# EAGLE design SingleBoard (EAGLE 9.4.2)
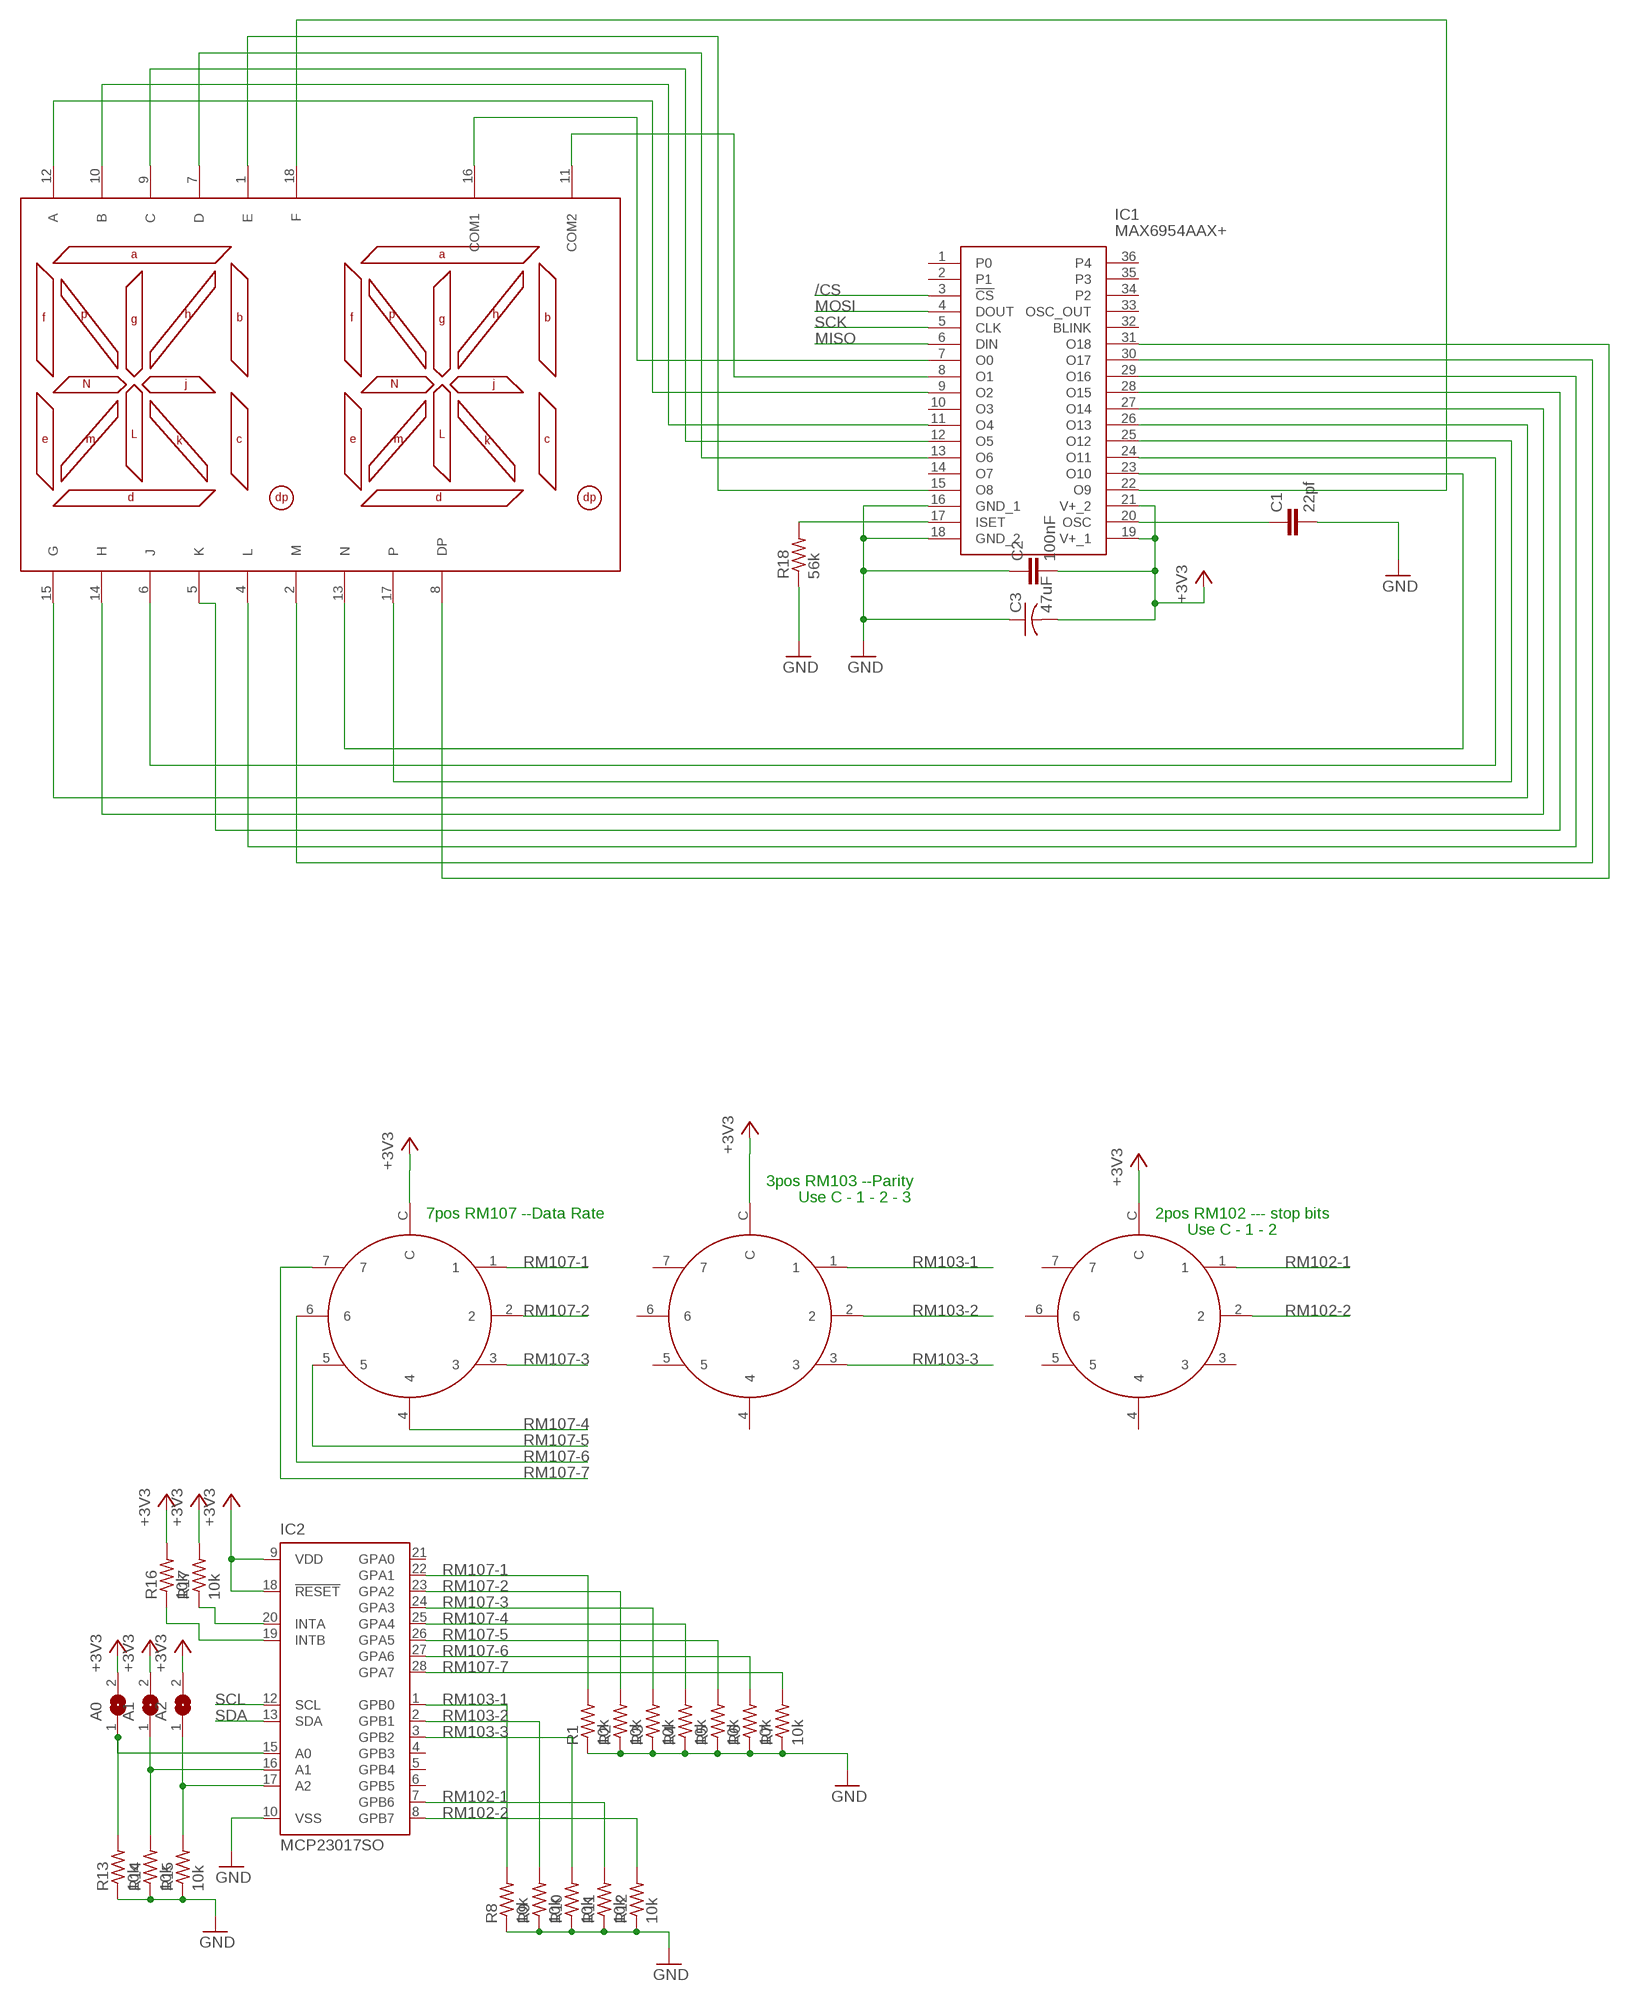
[diagram p0: schematic, sheet 1, part 1 of 2]
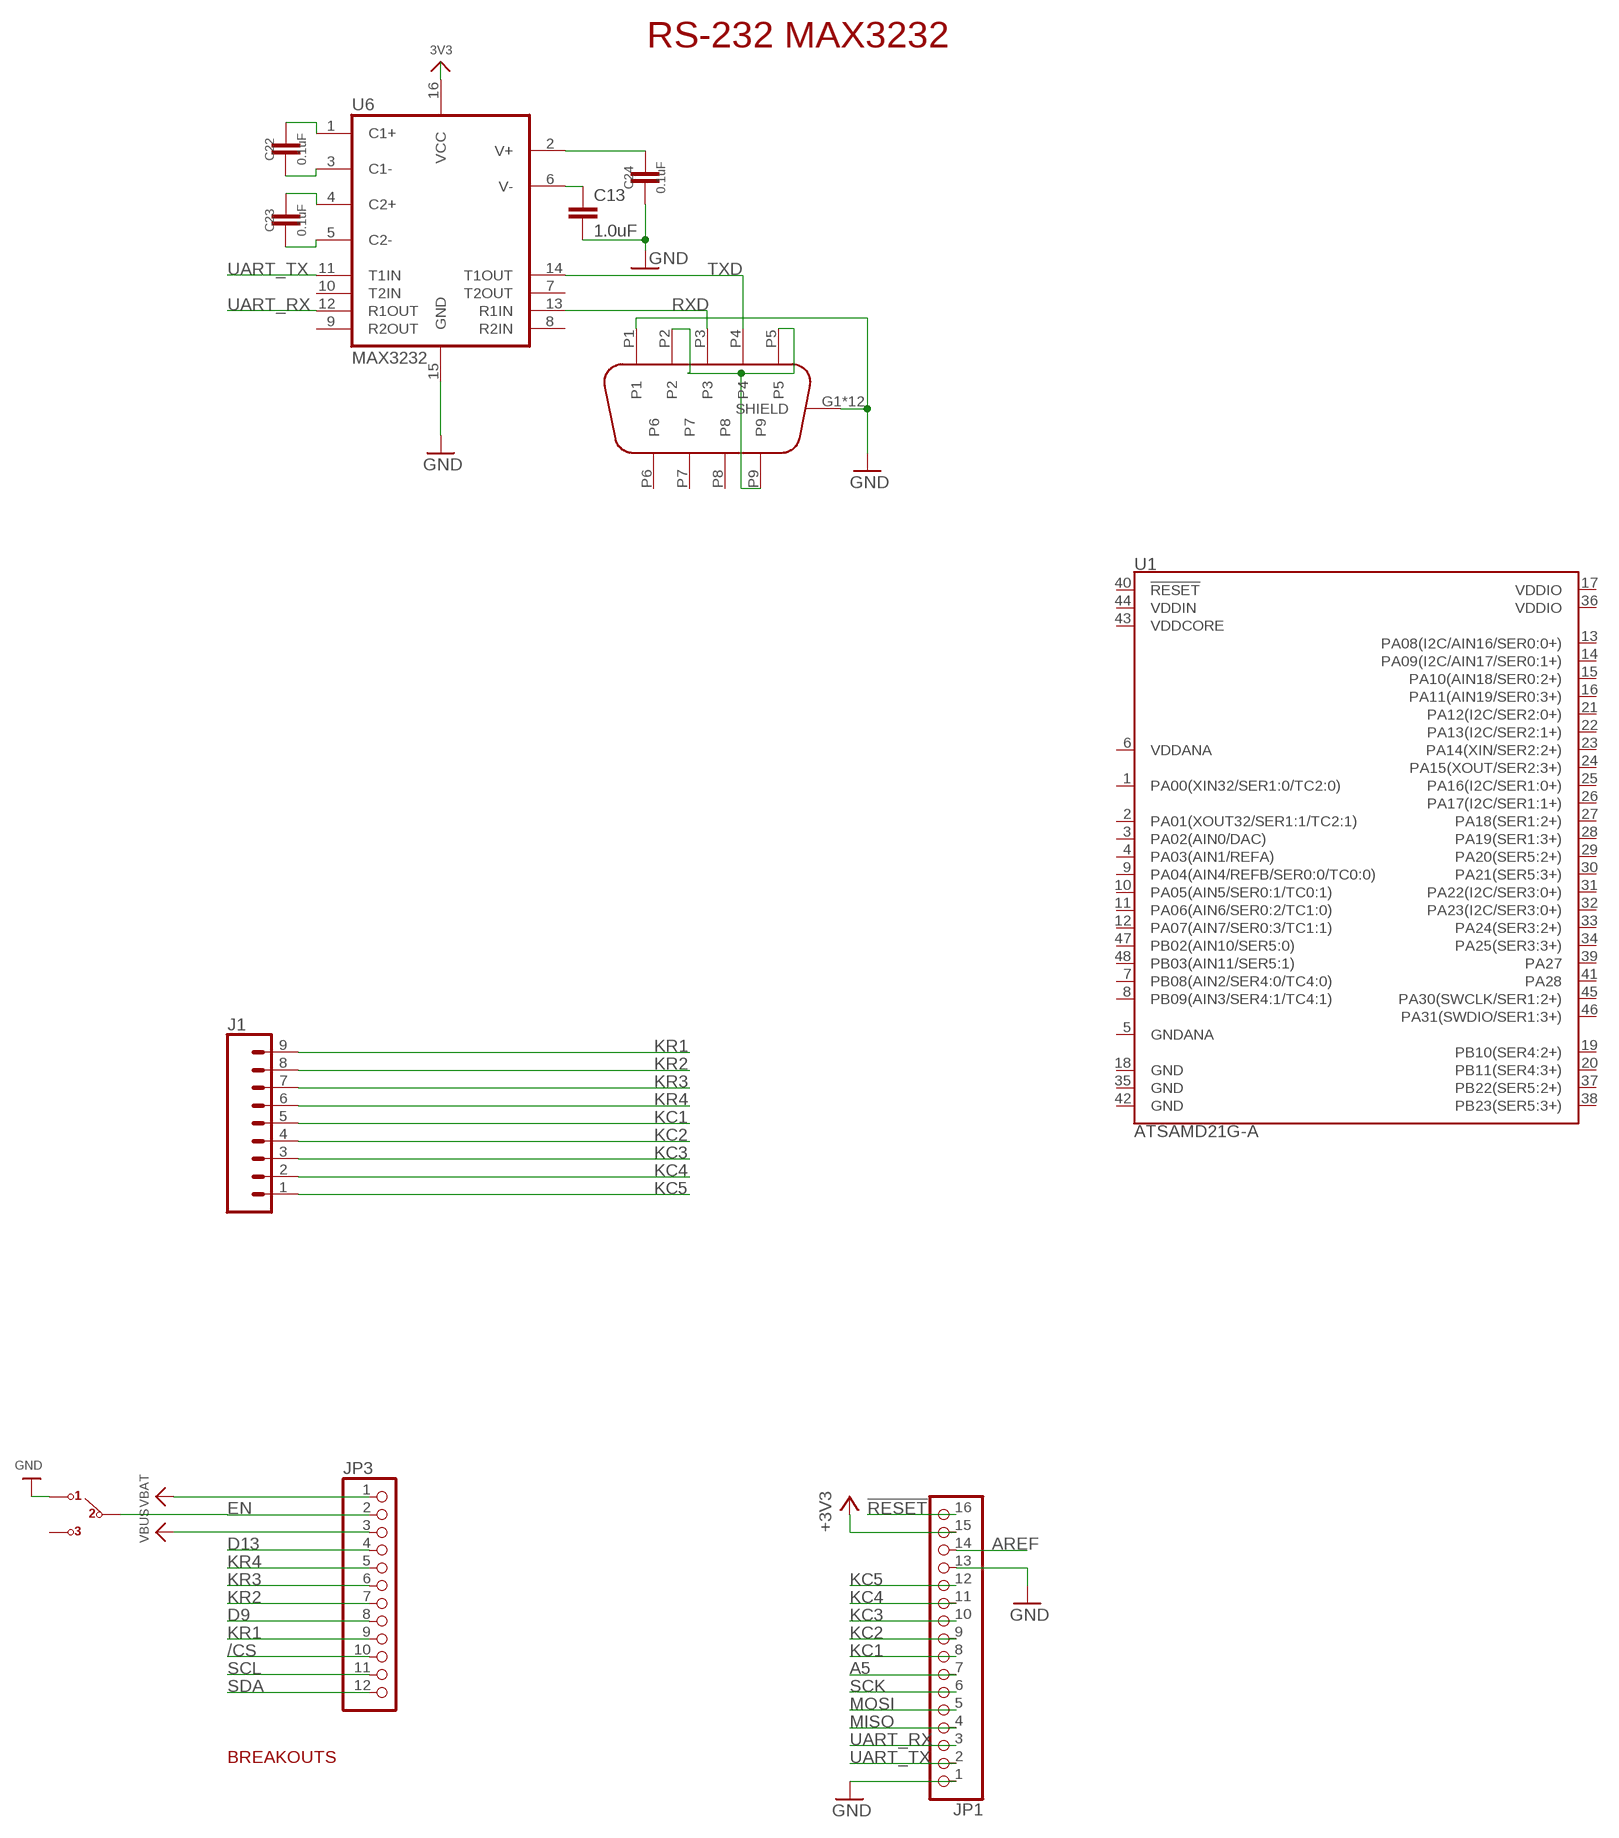
[diagram p1: schematic, sheet 1, part 2 of 2]

## Parts
A0  SJ  [SJ]
A1  SJ  [SJ]
A2  SJ  [SJ]
C1  22pf  1.0UF-0805-25V-(+80/-20%)  [0805]
C2  100nF  1.0UF-0805-25V-(+80/-20%)  [0805]
C3  47uF  C-USC1206  [C1206]
C13  1.0uF  1.0UF-0805-25V-10%  [0805]
C22  0.1uF  1.0UF-0805-25V-10%  [0805]
C23  0.1uF  1.0UF-0805-25V-10%  [0805]
C24  0.1uF  1.0UF-0805-25V-10%  [0805]
DE9FEMALE  EDGEMOUNTDE9  [DE09S065TLF]
IC1  MAX6954AAX+  [SOP80P1030X264-36N]
IC2  MCP23017SO  [SO28W]
J1  CONN_09  [1X09]
JP1  HEADER-1X16ROUND  [1X16_ROUND]
JP3  HEADER-1X12  [1X12_ROUND]
R1  10k  R-US_M0805  [M0805]
R2  10k  R-US_M0805  [M0805]
R3  10k  R-US_M0805  [M0805]
R4  10k  R-US_M0805  [M0805]
R5  10k  R-US_M0805  [M0805]
R6  10k  R-US_M0805  [M0805]
R7  10k  R-US_M0805  [M0805]
R8  10k  R-US_M0805  [M0805]
R9  10k  R-US_M0805  [M0805]
R10  10k  R-US_M0805  [M0805]
R11  10k  R-US_M0805  [M0805]
R12  10k  R-US_M0805  [M0805]
R13  10k  R-US_M0805  [M0805]
R14  10k  R-US_M0805  [M0805]
R15  10k  R-US_M0805  [M0805]
R16  10k  R-US_M0805  [M0805]
R17  10k  R-US_M0805  [M0805]
R18  56k  R-US_M0805  [M0805]
U1  ATSAMD21G-A  [TQFP-48]
U6  MAX3232  MAX2323SOIC16  [SO16]
U$1  BIG14SEG  [HDSP]
U$2  RM107772BCB  [RM107772BCB]
U$3  RM107772BCB  [RM107772BCB]
U$5  OS102011MA1QN1  [OS102011MA1QN1]
U$6  RM107772BCB  [RM107772BCB]

## Nets
3V3: U6.16(VCC)
!RESET: JP1.16
+3V3: A0.2 A1.2 A2.2 C2.2 C3.2 IC1.19(V+_1) IC1.21(V+_2) IC2.9(VDD) IC2.18(!RESET) JP1.15 R16.2 R17.2 U$2.C U$3.C U$6.C
/CS: IC1.3(!CS) JP3.10
A5: JP1.7
AREF: JP1.14
D9: JP3.8
D13: JP3.4
EN: JP3.2 U$5.P$2
GND: C1.2 C2.1 C3.1 C13.2 C24.2 DE9FEMALE.G1(SHIELD) DE9FEMALE.G2(SHIELD) DE9FEMALE.G3(SHIELD) DE9FEMALE.G4(SHIELD) DE9FEMALE.G5(SHIELD) DE9FEMALE.G6(SHIELD) DE9FEMALE.G7(SHIELD) DE9FEMALE.G8(SHIELD) DE9FEMALE.G9(SHIELD) DE9FEMALE.G10(SHIELD) DE9FEMALE.G11(SHIELD) DE9FEMALE.G12(SHIELD) DE9FEMALE.P1 IC1.16(GND_1) IC1.18(GND_2) IC2.10(VSS) JP1.1 JP1.13 R1.1 R2.1 R3.1 R4.1 R5.1 R6.1 R7.1 R8.1 R9.1 R10.1 R11.1 R12.1 R13.1 R14.1 R15.1 R18.1 U6.15(GND) U$5.P$1
KC1: J1.5 JP1.8
KC2: J1.4 JP1.9
KC3: J1.3 JP1.10
KC4: J1.2 JP1.11
KC5: J1.1 JP1.12
KR1: J1.9 JP3.9
KR2: J1.8 JP3.7
KR3: J1.7 JP3.6
KR4: J1.6 JP3.5
MISO: IC1.6(DIN) JP1.4
MOSI: IC1.4(DOUT) JP1.5
N$1: IC1.7(O0) U$1.16(COM1)
N$2: IC1.9(O2) U$1.12(A)
N$3: IC1.11(O4) U$1.10(B)
N$4: IC1.12(O5) U$1.9(C)
N$5: IC1.13(O6) U$1.7(D)
N$6: IC1.15(O8) U$1.1(E)
N$7: IC1.22(O9) U$1.18(F)
N$8: IC1.23(O10) U$1.13(N)
N$9: IC1.24(O11) U$1.6(J)
N$10: IC1.25(O12) U$1.17(P)
N$11: IC1.26(O13) U$1.15(G)
N$12: IC1.27(O14) U$1.14(H)
N$13: IC1.28(O15) U$1.5(K)
N$14: IC1.29(O16) U$1.4(L)
N$15: IC1.30(O17) U$1.2(M)
N$16: IC1.31(O18) U$1.8(DP)
N$17: IC1.8(O1) U$1.11(COM2)
N$18: C22.2 U6.3(C1-)
N$19: C22.1 U6.1(C1+)
N$20: C23.1 U6.4(C2+)
N$21: C23.2 U6.5(C2-)
N$22: C24.1 U6.2(V+)
N$23: C13.1 U6.6(V-)
N$24: DE9FEMALE.P2 DE9FEMALE.P5 DE9FEMALE.P9
N$25: A0.1 IC2.15(A0) R13.2
N$26: A1.1 IC2.16(A1) R14.2
N$27: A2.1 IC2.17(A2) R15.2
N$28: IC2.19(INTB) R16.1
N$29: IC2.20(INTA) R17.1
N$30: C1.1 IC1.20(OSC)
N$31: IC1.17(ISET) R18.2
RM102-1: IC2.7(GPB6) R11.2 U$6.1
RM102-2: IC2.8(GPB7) R12.2 U$6.2
RM103-1: IC2.1(GPB0) R8.2 U$3.1
RM103-2: IC2.2(GPB1) R9.2 U$3.2
RM103-3: IC2.3(GPB2) R10.2 U$3.3
RM107-1: IC2.22(GPA1) R1.2 U$2.1
RM107-2: IC2.23(GPA2) R2.2 U$2.2
RM107-3: IC2.24(GPA3) R3.2 U$2.3
RM107-4: IC2.25(GPA4) R4.2 U$2.4
RM107-5: IC2.26(GPA5) R5.2 U$2.5
RM107-6: IC2.27(GPA6) R6.2 U$2.6
RM107-7: IC2.28(GPA7) R7.2 U$2.7
RXD: DE9FEMALE.P3 U6.13(R1IN)
SCK: IC1.5(CLK) JP1.6
SCL: IC2.12(SCL) JP3.11
SDA: IC2.13(SDA) JP3.12
TXD: DE9FEMALE.P4 U6.14(T1OUT)
UART_RX: JP1.3 U6.12(R1OUT)
UART_TX: JP1.2 U6.11(T1IN)
VBAT: JP3.1
VBUS: JP3.3
Unconnected: DE9FEMALE.P6 DE9FEMALE.P7 DE9FEMALE.P8 IC1.1(P0) IC1.2(P1) IC1.10(O3) IC1.14(O7) IC1.32(BLINK) IC1.33(OSC_OUT) IC1.34(P2) IC1.35(P3) IC1.36(P4) IC2.4(GPB3) IC2.5(GPB4) IC2.6(GPB5) IC2.21(GPA0) U1.1(PA00(XIN32/SER1:0/TC2:0)) U1.2(PA01(XOUT32/SER1:1/TC2:1)) U1.3(PA02(AIN0/DAC)) U1.4(PA03(AIN1/REFA)) U1.5(GNDANA) U1.6(VDDANA) U1.7(PB08(AIN2/SER4:0/TC4:0)) U1.8(PB09(AIN3/SER4:1/TC4:1)) U1.9(PA04(AIN4/REFB/SER0:0/TC0:0)) U1.10(PA05(AIN5/SER0:1/TC0:1)) U1.11(PA06(AIN6/SER0:2/TC1:0)) U1.12(PA07(AIN7/SER0:3/TC1:1)) U1.13(PA08(I2C/AIN16/SER0:0+)) U1.14(PA09(I2C/AIN17/SER0:1+)) U1.15(PA10(AIN18/SER0:2+)) U1.16(PA11(AIN19/SER0:3+)) U1.17(VDDIO) U1.18(GND) U1.19(PB10(SER4:2+)) U1.20(PB11(SER4:3+)) U1.21(PA12(I2C/SER2:0+)) U1.22(PA13(I2C/SER2:1+)) U1.23(PA14(XIN/SER2:2+)) U1.24(PA15(XOUT/SER2:3+)) U1.25(PA16(I2C/SER1:0+)) U1.26(PA17(I2C/SER1:1+)) U1.27(PA18(SER1:2+)) U1.28(PA19(SER1:3+)) U1.29(PA20(SER5:2+)) U1.30(PA21(SER5:3+)) U1.31(PA22(I2C/SER3:0+)) U1.32(PA23(I2C/SER3:0+)) U1.33(PA24(SER3:2+)) U1.34(PA25(SER3:3+)) U1.35(GND) U1.36(VDDIO) U1.37(PB22(SER5:2+)) U1.38(PB23(SER5:3+)) U1.39(PA27) U1.40(!RESET!) U1.41(PA28) U1.42(GND) U1.43(VDDCORE) U1.44(VDDIN) U1.45(PA30(SWCLK/SER1:2+)) U1.46(PA31(SWDIO/SER1:3+)) U1.47(PB02(AIN10/SER5:0)) U1.48(PB03(AIN11/SER5:1)) U6.7(T2OUT) U6.8(R2IN) U6.9(R2OUT) U6.10(T2IN) U$3.4 U$3.5 U$3.6 U$3.7 U$5.CASE1(CASE) U$5.CASE2(CASE) U$5.P$3 U$6.3 U$6.4 U$6.5 U$6.6 U$6.7

## Notes on the sheet
- RS-232 MAX3232
- 3pos RM103 --Parity
- Use C - 1 - 2 - 3
- 7pos RM107 --Data Rate | 2pos RM102 --- stop bits
- Use C - 1 - 2
- BREAKOUTS

## Library data of the parts
A0 A1 A2 = jumper:SJ: SMD solder JUMPER
C1 C2 = SparkFun-Capacitors:1.0UF: 1µF ceramic capacitors A capacitor is a passive two-terminal electrical component used to store electrical energy temporarily in an electric field.; PROD_ID: CAP-11625; VALUE: 1.0uF
C3 = adafruit:C-US: CAPACITOR, American symbol
C13 = SparkFun-Capacitors:1.0UF: 1µF ceramic capacitors A capacitor is a passive two-terminal electrical component used to store electrical energy temporarily in an electric field.; PROD_ID: CAP-08064
C22-C24 = SparkFun-Capacitors:1.0UF: 1µF ceramic capacitors A capacitor is a passive two-terminal electrical component used to store electrical energy temporarily in an electric field.; PROD_ID: CAP-08064; VALUE: 1.0uF
DE9FEMALE = Serial:EDGEMOUNTDE9
IC1 = SamacSys_Parts:MAX6954AAX+: MAX6954AAX+, LED Display Driver, 16-Digits 128-Segments, 2.7 5.5 V, 36-Pin SSOP Source: Datasheet <https://componentsearchengine.com/Datasheets/1/MAX6954AAX .pdf>; DESCRIPTION: MAX6954AAX+, LED Display Driver, 16-Digits 128-Segments, 2.7 5.5 V, 36-Pin SSOP; HEIGHT: 2.64mm; MANUFACTURER_NAME: Maxim Integrated; MANUFACTURER_PART_NUMBER: MAX6954AAX+; MOUSER_PART_NUMBER: 700-MAX6954AAX; MOUSER_PRICE-STOCK: https://www.mouser.com/Search/Refine.aspx?Keyword=700-MAX6954AAX
IC2 = adafruit:MCP23017: http://ww1.microchip.com/downloads/en/DeviceDoc/21952a.pdf Source: http://ww1.microchip.com/downloads/en/DeviceDoc/21952a.pdf
J1 = SparkFun-Connectors:CONN_09: Multi connection point. Often used as Generic Header-pin footprint for 0.1 inch spaced/style header connections On any of the 0.1 inch spaced packages, you can populate with these: Break Away Headers - Straight <https://www.sparkfun.com/products/116> (PRT-00116) Break Away Male Headers - Right Angle <https://www.sparkfun.com/products/553> (PRT-00553) Female Headers <https://www.sparkfun.com/products/115> (PRT-00115) Break Away Headers - Machine Pin <https://www.sparkfun.com/products/117> (PRT-00117) Break Away Female Headers - Swiss Machine Pin <https://www.sparkfun.com/products/743> (PRT-00743) For SCREWTERMINALS and SPRING TERMINALS visit here: Screw Terimnals on SparkFun.com <https://www.sparkfun.com/search/results?term=Screw+Terminals> (5mm/3.5mm/2.54mm spacing) This device is also useful as a general connection point to wire up your design to another part of your project. Our various solder wires solder well into these plated through hole pads. Hook-Up Wire - Assortment (Stranded, 22 AWG) <https://www.sparkfun.com/products/11375> (PRT-11375) Hook-Up Wire - Assortment (Solid Core, 22 AWG) <https://www.sparkfun.com/products/11367> (PRT-11367) View the entire wire category on our website here <https://www.sparkfun.com/categories/141> Special notes: Molex polarized connector foot print use with SKU : PRT-08231 with associated crimp pins and housings. 1MM SMD Version SKU: PRT-10208 NOTES ON THE VARIANTS LOCK and LOCK_LONGPADS... This footprint was designed to help hold the alignment of a through-hole component (i.e. 6-pin header) while soldering it into place. You may notice that each hole has been shifted either up or down by 0.005 of an inch from it's more standard position (which is a perfectly straight line). This slight alteration caused the pins (the squares in the middle) to touch the edges of the holes. Because they are alternating, it causes a "brace" to hold the component in place. 0.005 has proven to be the perfect amount of "off-center" position when using our standard breakaway headers. Although looks a little odd when you look at the bare footprint, once you have a header in there, the alteration is very hard to notice. Also,if you push a header all the way into place, it is covered up entirely on the bottom side.
JP1 = microbuilder:HEADER-1X16: PIN HEADER
JP3 = microbuilder:HEADER-1X12
R1-R18 = resistor:R-US_: RESISTOR, American symbol
U1 = SparkFun-IC-Microcontroller:ATSAMD21G: Atmel SAMD21G SMART ARM-Based Microcontroller The Atmel ® | SMART ™ SAM D21 is a series of low-power microcontrollers using the 32-bit ARM ® Cortex ® -M0+ processor, and ranging from 32- to 64-pins with up to 256KB Flash and 32KB of SRAM. The SAM D21 devices operate at a maximum frequency of 48MHz and reach 2.46 CoreMark/MHz. They are designed for simple and intuitive migration with identical peripheral modules, hex compatible code, identical linear address map and pin compatible migration paths between all devices in the product series. All devices include intelligent and flexible peripherals, Atmel Event System for inter-peripheral signaling, and support for capacitive touch button, slider and wheel user interfaces. Datasheet <https://cdn.sparkfun.com/datasheets/Dev/Arduino/Boards/Atmel-42181-SAM-D21_Datasheet.pdf> SparkFun Products SparkFun SAMD21 Mini Breakout <https://www.sparkfun.com/products/13664> (DEV-13664) SparkFun SAMD21 Dev Breakout <https://www.sparkfun.com/products/13672> (DEV-13672); PROD_ID: IC-13064
U6 = SparkFun-IC-Comms:MAX2323: RS232 Transceiver This part covers 232 drivers that are compatible with the MAX3232. Sipex SP3232EB Datasheet <http://cdn.sparkfun.com/datasheets/Components/General%20IC/SP3232EBCA-L.pdf> SparkFun Products SOIC component <https://www.sparkfun.com/products/589> (COM-00589 / IC-08171) Retired DIP component (COM-00316 / IC-08446) SparkFun Transceiver Breakout - MAX3232 <https://www.sparkfun.com/products/11189> (BOB-11189) SparkFun XBee Explorer Serial <https://www.sparkfun.com/products/13225> (WRL-13225); PROD_ID: IC-08171
U$1 = Segment displays:BIG14SEG
U$2 U$3 U$6 = Segment displays:RM107772BCB
U$5 = FPC:OS102011MA1QN1

## Board
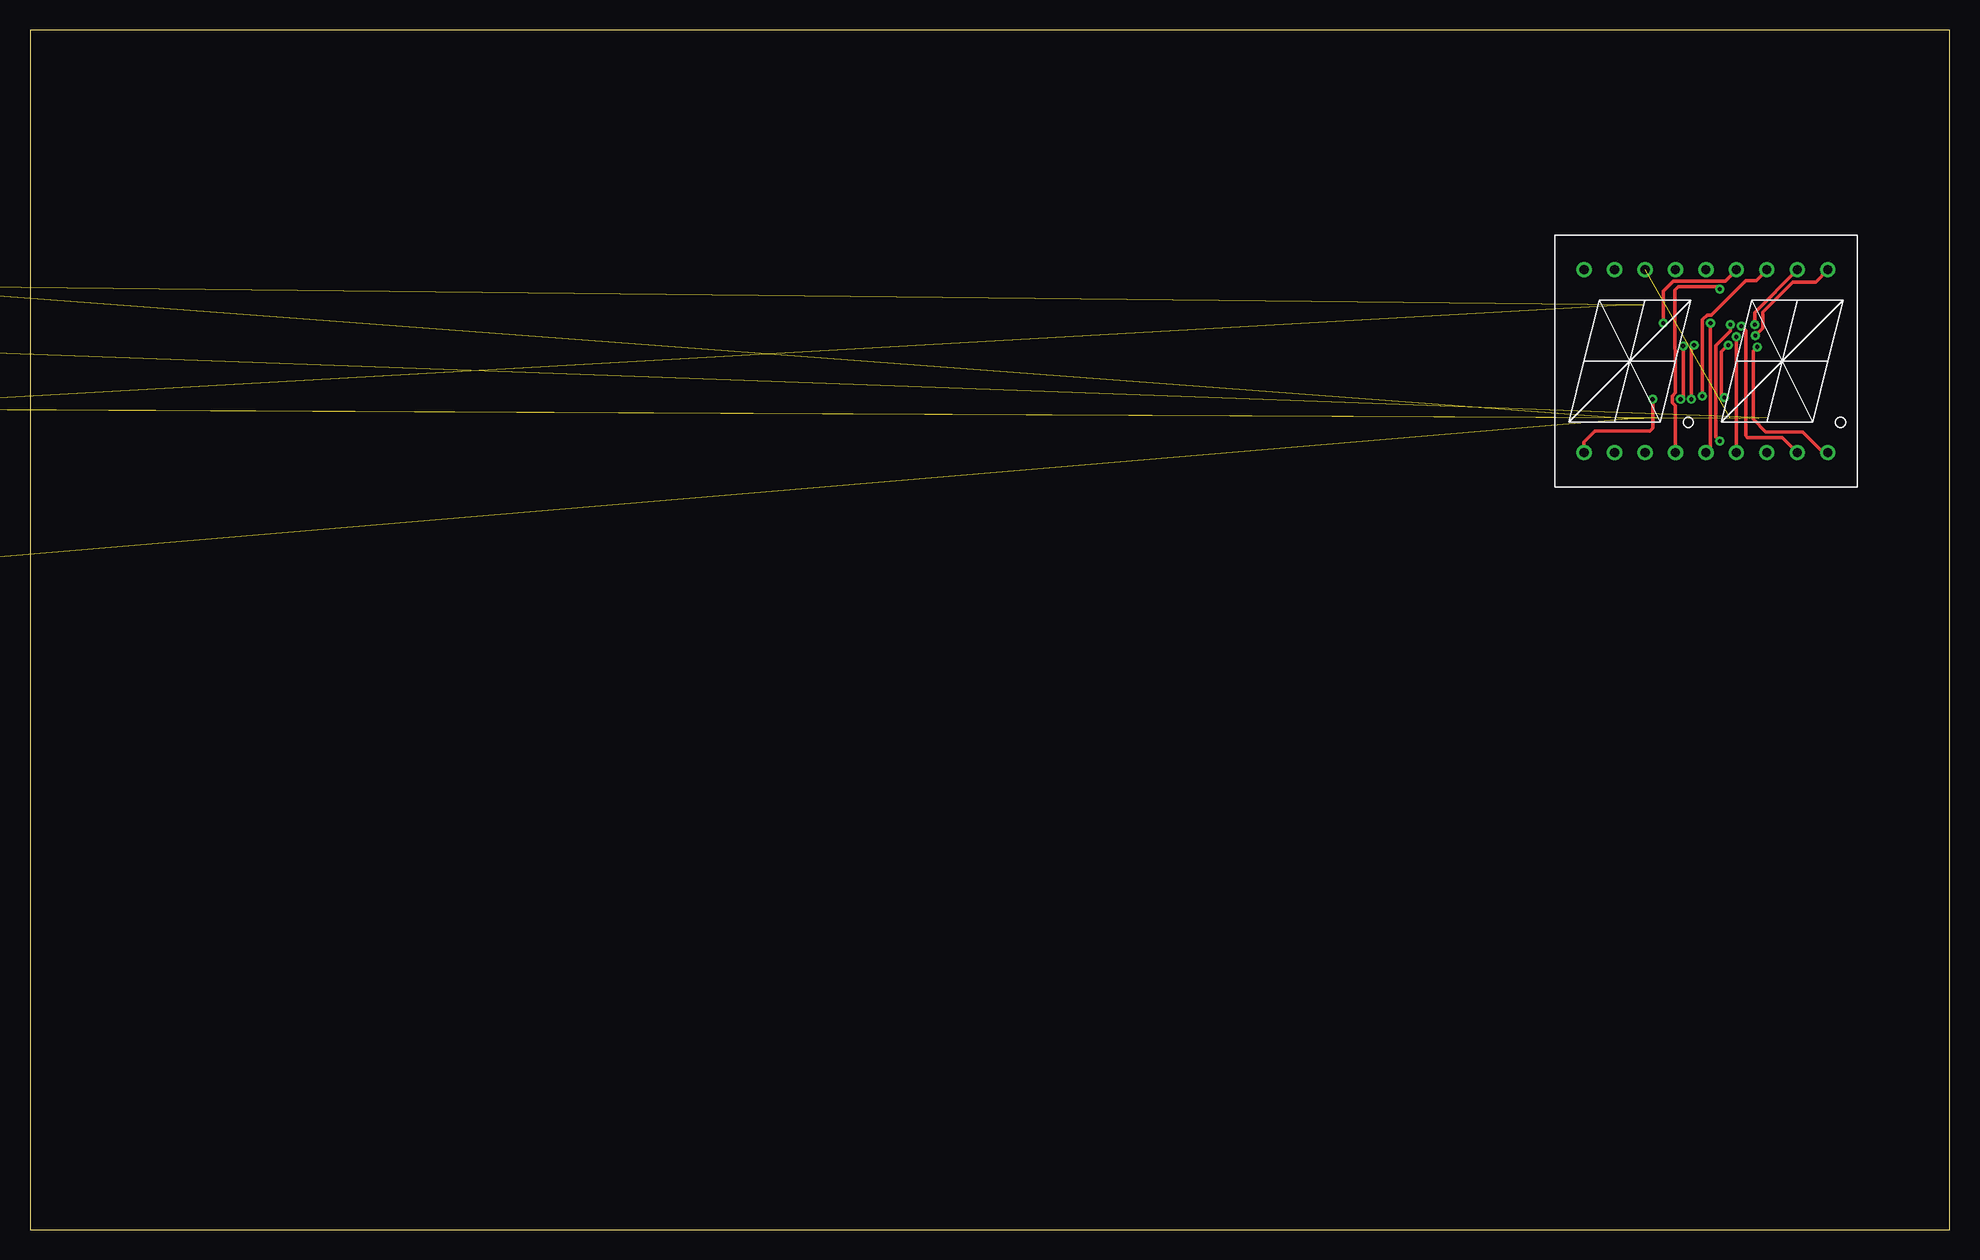
[diagram p2: board, top side]
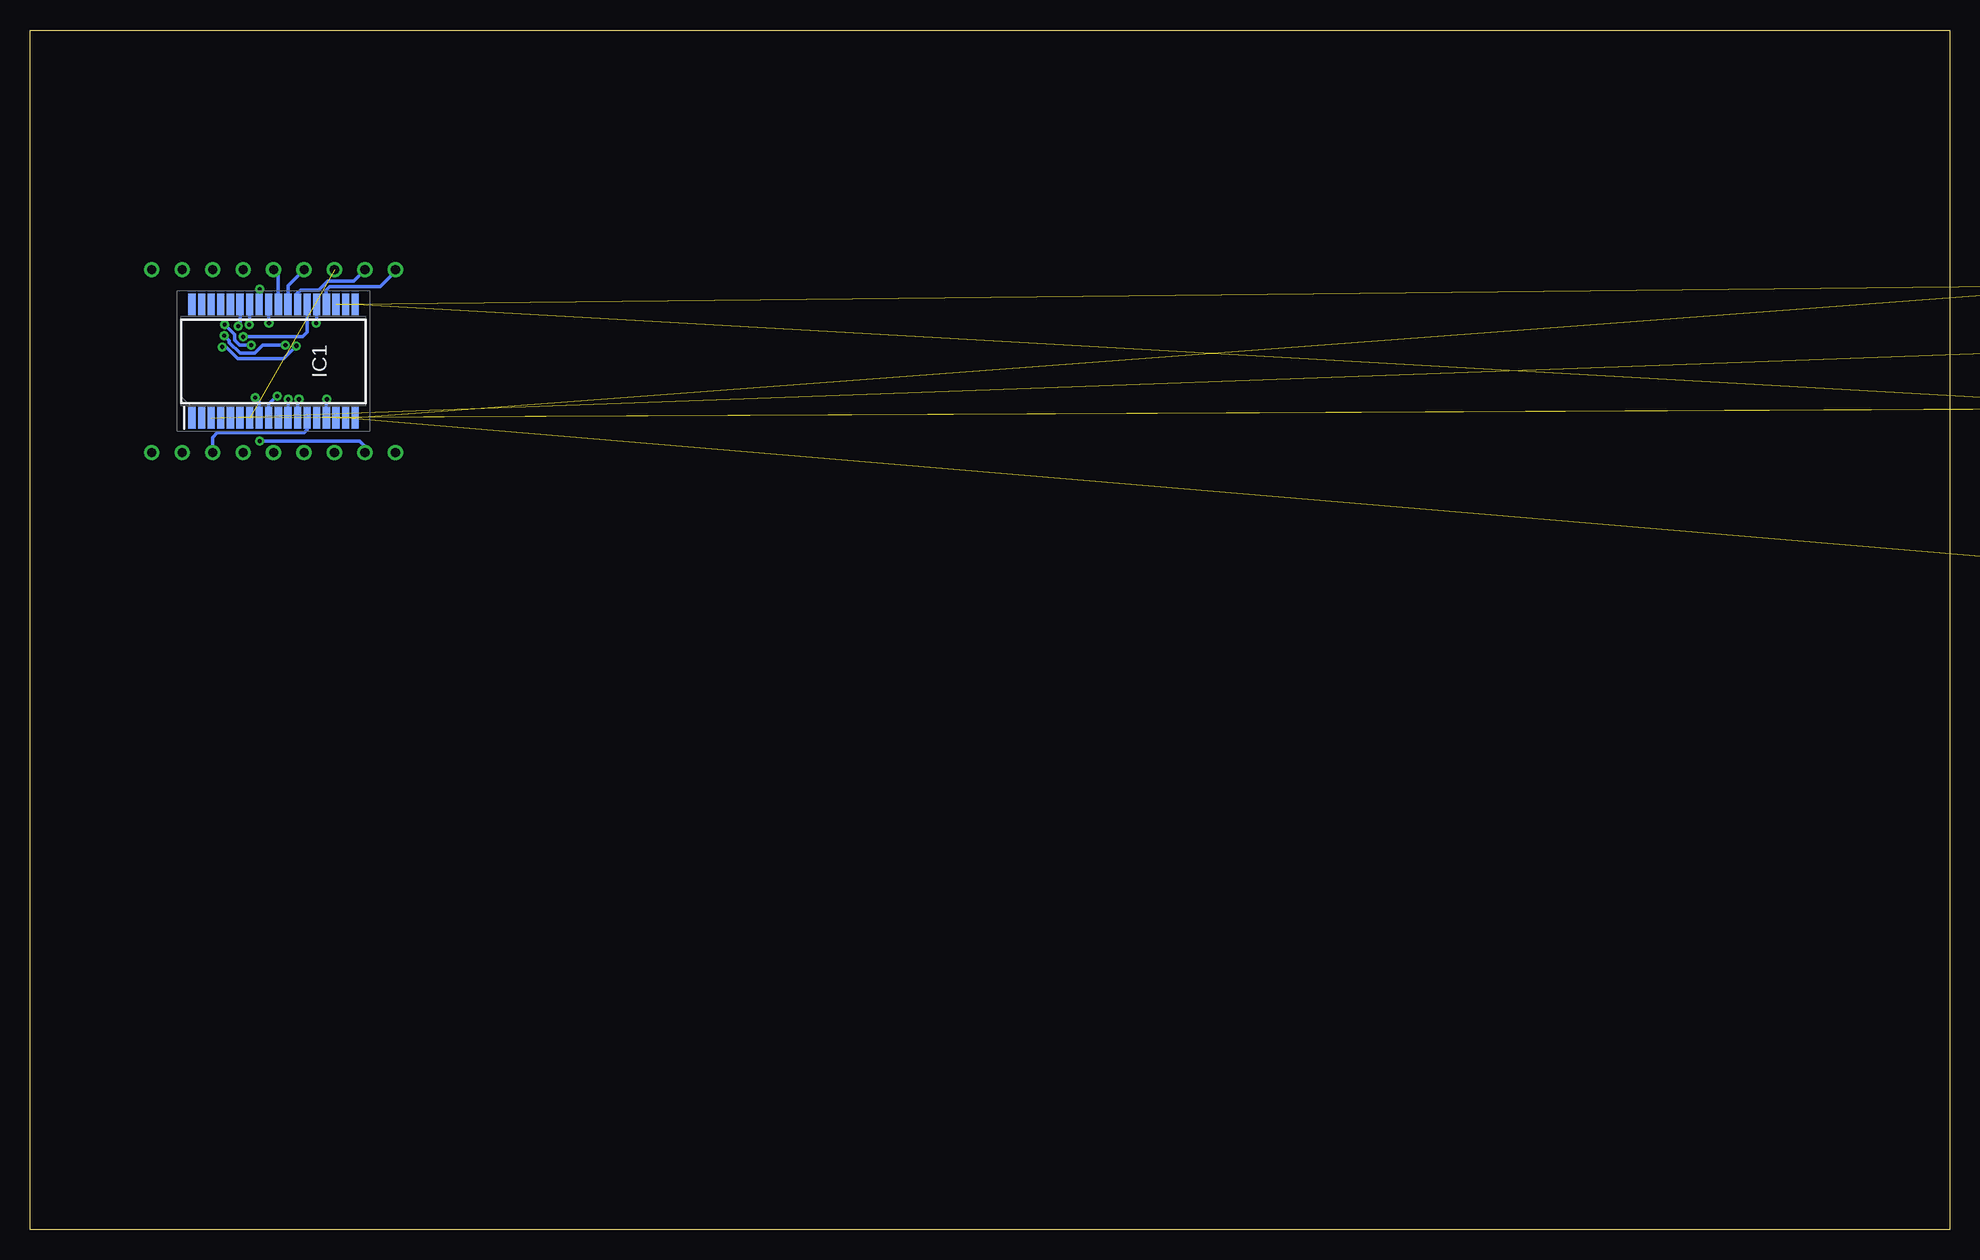
[diagram p3: board, bottom side, seen from below]

Size 160 x 100 mm. Coordinates in mm from the lower left corner, seen from the top.
Outline: 0,0 160,0 160,100 0,100 0,0
Copper layers (1*16): Top 0.035mm / dielectric 1.5mm / Bottom 0.035mm
Design rules "default": minimum track width 6mil, minimum drill 0.35mm, track to track 6mil, track to pad 6mil, pad to pad 6mil, via to via 6mil, smd to smd 6mil, copper to edge 40mil, drill to drill 6mil, minimum pad ring 10mil, minimum via ring 8mil, stop-mask expansion 4mil, vias tented up to drill 0mil, thermal gap 10mil

### Footprints (pad centres in the part's own frame; a part is rotated, then mirrored left to right if it is on the bottom)
SJ = smd 1.168 x 1.6: 1 -0.762,0; 2 0.762,0
0805 = smd 0.8 x 1.2: 1 -0.9,0; 2 0.9,0
C1206 = smd 1.6 x 1.8: 1 -1.4,0; 2 1.4,0
DE09S065TLF = drill 0.6: G1 -15,4.5; G2 -12,4.5; G3 -15,1.5; G4 -12,1.5; G5 12,4.5; G6 15,4.5; G7 12,1.5; G8 15,1.5 | smd 5 x 5 bottom: G9 13.5,3; G10 -13.5,3 | smd 5 x 5: G11 -13.5,3; G12 13.5,3 | smd 1.54 x 3: P1 5.48,-1.37; P2 2.74,-1.37; P3 0,-1.37; P4 -2.74,-1.37; P5 -5.48,-1.37 | smd 1.54 x 3 bottom: P6 4.11,-1.37; P7 1.37,-1.37; P8 -1.37,-1.37; P9 -4.11,-1.37
SOP80P1030X264-36N = smd 1.8 x 0.6: 1 -4.725,6.8; 2 -4.725,6; 3 -4.725,5.2; 4 -4.725,4.4; 5 -4.725,3.6; 6 -4.725,2.8; 7 -4.725,2; 8 -4.725,1.2; 9 -4.725,0.4; 10 -4.725,-0.4; 11 -4.725,-1.2; 12 -4.725,-2; 13 -4.725,-2.8; 14 -4.725,-3.6; 15 -4.725,-4.4; 16 -4.725,-5.2; 17 -4.725,-6; 18 -4.725,-6.8; 19 4.725,-6.8; 20 4.725,-6; 21 4.725,-5.2; 22 4.725,-4.4; 23 4.725,-3.6; 24 4.725,-2.8; 25 4.725,-2; 26 4.725,-1.2; 27 4.725,-0.4; 28 4.725,0.4; 29 4.725,1.2; 30 4.725,2; 31 4.725,2.8; 32 4.725,3.6; 33 4.725,4.4; 34 4.725,5.2; 35 4.725,6; 36 4.725,6.8
SO28W = smd 0.762 x 1.27: 1 -7.62,-4.78; 2 -6.35,-4.78; 3 -5.08,-4.78; 4 -3.81,-4.78; 5 -2.54,-4.78; 6 -1.27,-4.78; 7 0,-4.78; 8 1.27,-4.78; 9 2.54,-4.78; 10 3.81,-4.78; 11 5.08,-4.78; 12 6.35,-4.78; 13 7.62,-4.78; 14 8.89,-4.78; 15 8.89,4.78; 16 7.62,4.78; 17 6.35,4.78; 18 5.08,4.78; 19 3.81,4.78; 20 2.54,4.78; 21 1.27,4.78; 22 0,4.78; 23 -1.27,4.78; 24 -2.54,4.78; 25 -3.81,4.78; 26 -5.08,4.78; 27 -6.35,4.78; 28 -7.62,4.78
1X09 = drill 1.016 pad 1.88: 1 0,0; 2 2.54,0; 3 5.08,0; 4 7.62,0; 5 10.16,0; 6 12.7,0; 7 15.24,0; 8 17.78,0; 9 20.32,0
1X16_ROUND = drill 1 pad 1.676: 1 -19.05,0; 2 -16.51,0; 3 -13.97,0; 4 -11.43,0; 5 -8.89,0; 6 -6.35,0; 7 -3.81,0; 8 -1.27,0; 9 1.27,0; 10 3.81,0; 11 6.35,0; 12 8.89,0; 13 11.43,0; 14 13.97,0; 15 16.51,0; 16 19.05,0
1X12_ROUND = drill 1 pad 1.676: 1 -13.97,0; 2 -11.43,0; 3 -8.89,0; 4 -6.35,0; 5 -3.81,0; 6 -1.27,0; 7 1.27,0; 8 3.81,0; 9 6.35,0; 10 8.89,0; 11 11.43,0; 12 13.97,0
M0805 = smd 1.3 x 1.6: 1 -0.95,0; 2 0.95,0
TQFP-48 = smd 1.5 x 0.28: 1 -4.25,2.75; 2 -4.25,2.25; 3 -4.25,1.75; 4 -4.25,1.25; 5 -4.25,0.75; 6 -4.25,0.25; 7 -4.25,-0.25; 8 -4.25,-0.75; 9 -4.25,-1.25; 10 -4.25,-1.75; 11 -4.25,-2.25; 12 -4.25,-2.75; 25 4.25,-2.75; 26 4.25,-2.25; 27 4.25,-1.75; 28 4.25,-1.25; 29 4.25,-0.75; 30 4.25,-0.25; 31 4.25,0.25; 32 4.25,0.75; 33 4.25,1.25; 34 4.25,1.75; 35 4.25,2.25; 36 4.25,2.75 | smd 0.28 x 1.5: 13 -2.75,-4.25; 14 -2.25,-4.25; 15 -1.75,-4.25; 16 -1.25,-4.25; 17 -0.75,-4.25; 18 -0.25,-4.25; 19 0.25,-4.25; 20 0.75,-4.25; 21 1.25,-4.25; 22 1.75,-4.25; 23 2.25,-4.25; 24 2.75,-4.25; 37 2.75,4.25; 38 2.25,4.25; 39 1.75,4.25; 40 1.25,4.25; 41 0.75,4.25; 42 0.25,4.25; 43 -0.25,4.25; 44 -0.75,4.25; 45 -1.25,4.25; 46 -1.75,4.25; 47 -2.25,4.25; 48 -2.75,4.25
SO16 = smd 0.6 x 1.2: 1 -4.445,-2.8; 2 -3.175,-2.8; 3 -1.905,-2.8; 4 -0.635,-2.8; 5 0.635,-2.8; 6 1.905,-2.8; 7 3.175,-2.8; 8 4.445,-2.8; 9 4.445,2.8; 10 3.175,2.8; 11 1.905,2.8; 12 0.635,2.8; 13 -0.635,2.8; 14 -1.905,2.8; 15 -3.175,2.8; 16 -4.445,2.8
HDSP = drill 0.762: 1 -10.16,-7.62; 2 -7.62,-7.62; 3 -5.08,-7.62; 4 -2.54,-7.62; 5 0,-7.62; 6 2.54,-7.62; 7 5.08,-7.62; 8 7.62,-7.62; 9 10.16,-7.62; 10 10.16,7.62; 11 7.62,7.62; 12 5.08,7.62; 13 2.54,7.62; 14 0,7.62; 15 -2.54,7.62; 16 -5.08,7.62; 17 -7.62,7.62; 18 -10.16,7.62
RM107772BCB = drill 0.95: 1 1.778,1.778; 2 2.54,0; 3 1.778,-1.778; 4 0,-2.54; 5 -1.778,-1.651; 6 -2.54,0; 7 -1.778,1.778; C 0,2.413
OS102011MA1QN1 = drill 1.524 pad 2 long: CASE1 0,0; CASE2 8.204,0 | drill 0.85 pad 1.27: P$1 2.108,0; P$2 4.115,0; P$3 6.121,0

### Placement (x,y rotation side)
A0  -26.67,63.5 0 top  (outside the outline)
A1  -31.75,63.5 0 top  (outside the outline)
A2  -36.83,63.5 0 top  (outside the outline)
C1  -15.24,78.74 0 top  (outside the outline)
C2  -19.05,78.74 0 top  (outside the outline)
C3  -67.31,58.42 0 top  (outside the outline)
C13  -22.86,78.74 0 top  (outside the outline)
C22  -26.67,78.74 0 top  (outside the outline)
C23  -30.48,78.74 0 top  (outside the outline)
C24  -34.29,78.74 0 top  (outside the outline)
DE9FEMALE  -30.48,41.91 0 top  (outside the outline)
IC1  139.7,72.39 90 bottom
IC2  -31.75,2.54 0 bottom  (outside the outline)
J1  -66.04,73.66 0 top  (outside the outline)
JP1  -33.02,68.58 0 top  (outside the outline)
JP3  -27.94,73.66 0 top  (outside the outline)
R1  -20.32,58.42 0 top  (outside the outline)
R2  -25.4,58.42 0 top  (outside the outline)
R3  -30.48,58.42 0 top  (outside the outline)
R4  -35.56,58.42 0 top  (outside the outline)
R5  -40.64,58.42 0 top  (outside the outline)
R6  -45.72,58.42 0 top  (outside the outline)
R7  -50.8,58.42 0 top  (outside the outline)
R8  -55.88,58.42 0 top  (outside the outline)
R9  -60.96,58.42 0 top  (outside the outline)
R10  -30.48,50.8 0 top  (outside the outline)
R11  -15.24,58.42 0 top  (outside the outline)
R12  -35.56,50.8 0 top  (outside the outline)
R13  -40.64,50.8 0 top  (outside the outline)
R14  -45.72,50.8 0 top  (outside the outline)
R15  -50.8,50.8 0 top  (outside the outline)
R16  -55.88,50.8 0 top  (outside the outline)
R17  -60.96,50.8 0 top  (outside the outline)
R18  -66.04,50.8 0 top  (outside the outline)
U1  -33.02,29.21 0 top  (outside the outline)
U6  -54.61,43.18 0 top  (outside the outline)
U$1  139.7,72.39 0 top
U$2  -64.77,41.91 0 top  (outside the outline)
U$3  -16.51,52.07 0 top  (outside the outline)
U$5  -22.86,64.77 0 top  (outside the outline)
U$6  -24.13,52.07 0 top  (outside the outline)

### Tracks (layer width: path | path; a pad name or v marks a point on that pad's centre or on a via)
+3V3  (14 unrouted)
/CS  (1 unrouted)
EN  (1 unrouted)
GND  (40 unrouted)
KC1  (1 unrouted)
KC2  (1 unrouted)
KC3  (1 unrouted)
KC4  (1 unrouted)
KC5  (1 unrouted)
KR1  (1 unrouted)
KR2  (1 unrouted)
KR3  (1 unrouted)
KR4  (1 unrouted)
MISO  (1 unrouted)
MOSI  (1 unrouted)
N$1  (1 unrouted)
N$2  (via drill 0.35)
  Top 0.305: U$1.12 143.89,79.12 143,79.12 140.13,76.25 139.8,76.25 139.4,75.85 v139.4,69.47
  Bottom 0.305: v139.4,69.47 139.45,69.47 140.1,68.81 IC1.9
N$3  (via drill 0.35)
  Top 0.305: v138.49,69.22 138.49,73.51 v138.72,73.74 | v143.82,74.53 144.45,75.16 144.45,76.49 146.95,78.99 148.84,78.99 U$1.10
  Bottom 0.305: IC1.11 138.5,69.2 v138.49,69.22 | v143.82,74.53 143.38,74.09 143.38,73.95 142.49,73.06 141.27,73.06 140.59,73.74 v138.72,73.74
N$4  (via drill 0.35)
  Top 0.305: U$1.9 149.48,64.77 147.96,66.29 147.75,66.5 145.16,66.5 144.7,66.5 143.64,67.56 143.64,73.24 v143.97,73.58 | v137.79,73.66 137.79,69.43 v137.58,69.22
  Bottom 0.305: v143.97,73.58 143.65,73.58 142.68,72.6 142.24,72.6 138.86,72.6 v137.79,73.66 | v137.58,69.22 137.7,69.09 IC1.12
N$5
  Bottom 0.305: IC1.13 136.9,66.68 137.16,66.42 144.4,66.42 144.78,66.04 U$1.7
N$6  (via drill 0.35)
  Top 0.305: U$1.1 129.54,65.66 130.43,66.55 135,66.55 135.25,66.8 v135.25,69.22
  Bottom 0.305: v135.25,69.22 135.3,69.17 IC1.15
N$7
  Bottom 0.305: IC1.22 135.3,78.31 135,78.61 130.81,78.61 129.54,79.88 U$1.18
N$8  (via drill 0.35)
  Top 0.305: v136.14,75.56 136.14,78.23 136.98,79.07 141.3,79.07 U$1.13
  Bottom 0.305: IC1.23 136.1,75.61 v136.14,75.56
N$9  (via drill 0.35)
  Top 0.305: U$1.6 v142.24,74.42
  Bottom 0.305: v142.24,74.42 137.29,74.42 136.9,74.81 IC1.24
N$10
  Bottom 0.305: U$1.17 133.02,79.07 135.19,79.07 135.94,78.32 137.45,78.32 137.79,77.98 137.79,77.21 IC1.25
N$11
  Bottom 0.305: U$1.15 138.5,78.67 IC1.26
N$12
  Bottom 0.305: U$1.14 139.3,79.61 IC1.27
N$13  (via drill 0.35)
  Top 0.305: v140.08,75.56 140.08,65.15 U$1.5
  Bottom 0.305: IC1.28 140.1,75.58 v140.08,75.56
N$14  (via drill 0.35)
  Top 0.305: v140.84,78.39 140.62,78.61 137.41,78.61 137.11,78.31 137.11,73.38 137.16,73.33 137.16,69.76 136.9,69.5 136.9,68.93 137.16,68.67 U$1.4
  Bottom 0.305: v140.84,78.39 140.9,78.33 IC1.29
N$15  (via drill 0.35)
  Top 0.305: v141.73,75.44 141.73,74.88 140.54,73.69 140.54,66.04 v140.84,65.74
  Bottom 0.305: IC1.30 141.7,75.47 v141.73,75.44 | v140.84,65.74 132.54,65.74 132.08,65.28 U$1.2
N$16  (via drill 0.35)
  Top 0.305: U$1.8 146.05,66.04 143.13,66.04 143,66.17 143,74.94 v142.64,75.31
  Bottom 0.305: v142.64,75.31 142.5,75.45 IC1.31
N$17  (via drill 0.35)
  Top 0.305: U$1.11 143.76,76.45 v143.76,75.44 | v141.56,73.74 141,73.18 141,69.57 v141.22,69.34
  Bottom 0.305: v143.76,75.44 142.92,74.6 142.92,74.14 142.52,73.74 v141.56,73.74 | v141.22,69.34 140.9,69.02 IC1.8
N$18  (1 unrouted)
N$19  (1 unrouted)
N$20  (1 unrouted)
N$21  (1 unrouted)
N$22  (1 unrouted)
N$23  (1 unrouted)
N$24  (2 unrouted)
N$25  (2 unrouted)
N$26  (2 unrouted)
N$27  (2 unrouted)
N$28  (1 unrouted)
N$29  (1 unrouted)
N$30  (1 unrouted)
N$31  (1 unrouted)
RM102-1  (2 unrouted)
RM102-2  (2 unrouted)
RM103-1  (2 unrouted)
RM103-2  (2 unrouted)
RM103-3  (2 unrouted)
RM107-1  (2 unrouted)
RM107-2  (2 unrouted)
RM107-3  (2 unrouted)
RM107-4  (2 unrouted)
RM107-5  (2 unrouted)
RM107-6  (2 unrouted)
RM107-7  (2 unrouted)
RXD  (1 unrouted)
SCK  (1 unrouted)
SCL  (1 unrouted)
SDA  (1 unrouted)
TXD  (1 unrouted)
UART_RX  (1 unrouted)
UART_TX  (1 unrouted)